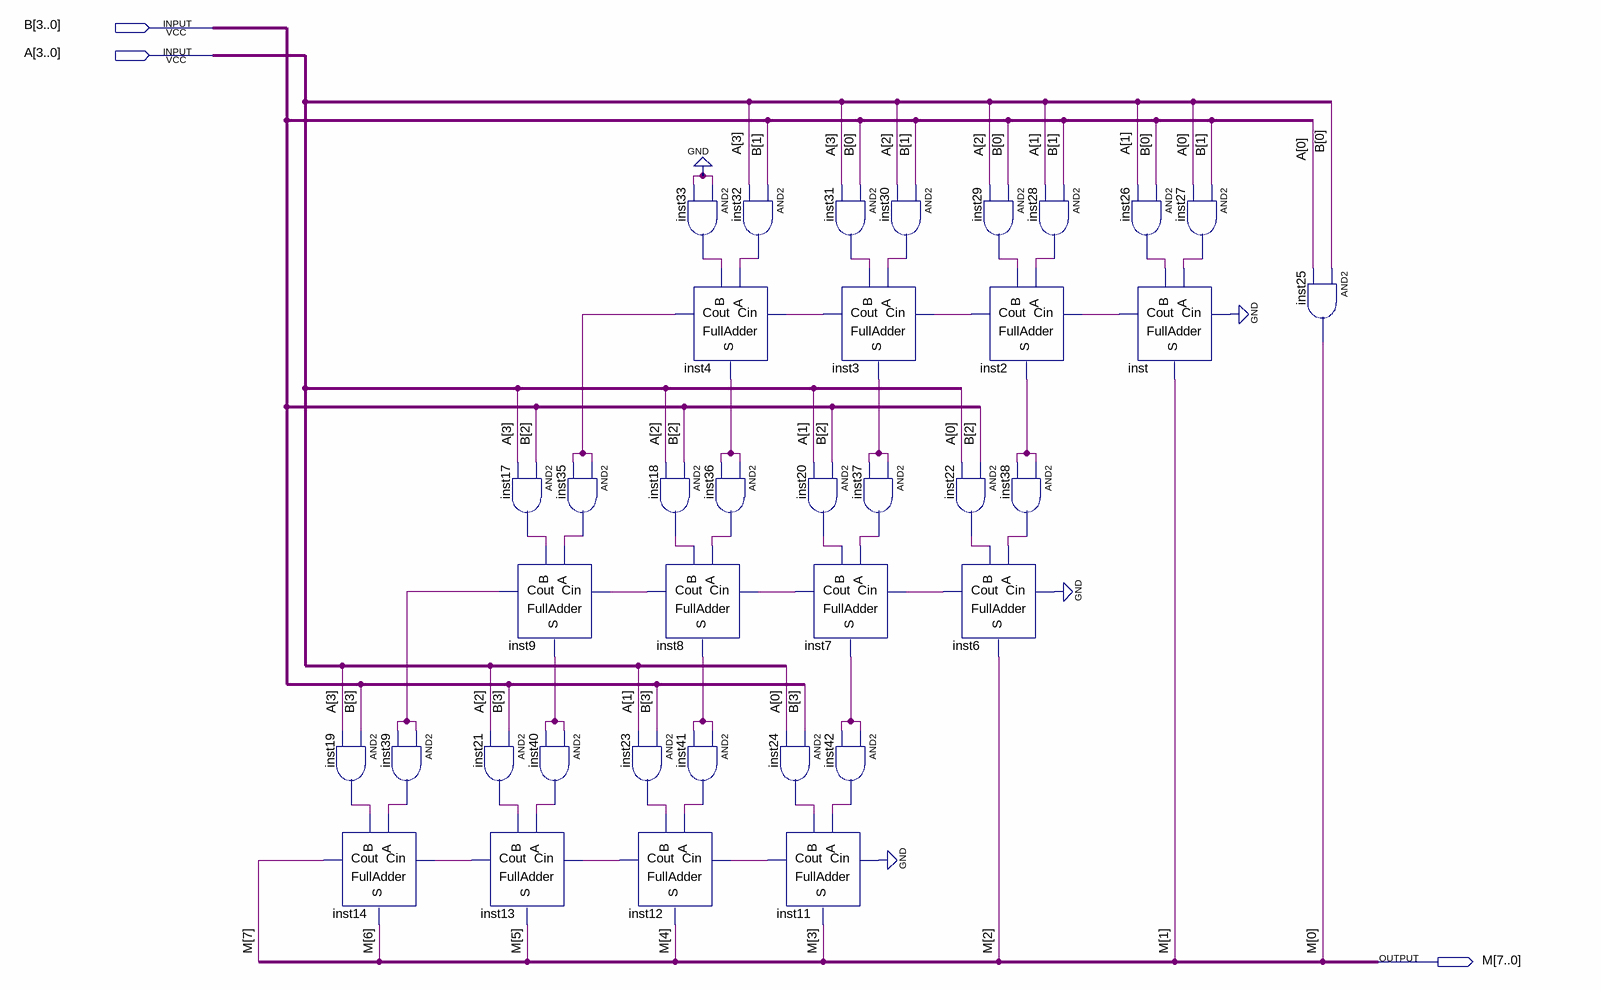
[diagram p0: schematic sheet]
// Quartus schematic Mult.bdf as structural Verilog: 37 symbols, 3 pins
module Mult (
  input  [3:0] B,
  input  [3:0] A,
  output [7:0] M
);

  wire inst2_cout, inst2_s, inst3_cout, inst3_s, inst4_cout, inst4_s, inst6_cout, inst7_cout, inst7_s,
       inst8_cout, inst8_s, inst9_cout, inst9_s, inst11_cout, inst12_cout, inst13_cout, inst17_out,
       inst18_out, inst19_out, inst20_out, inst21_out, inst22_out, inst23_out, inst24_out, inst26_out,
       inst27_out, inst28_out, inst29_out, inst30_out, inst31_out, inst32_out, inst33_out, inst35_out,
       inst36_out, inst37_out, inst38_out, inst39_out, inst40_out, inst41_out, inst42_out, inst_cout;

  and inst19 (inst19_out, B[3], A[3]);
  FullAdder inst14 (.B(inst19_out), .A(inst39_out), .Cin(inst13_cout), .S(M[6]), .Cout(M[7]));
  and inst39 (inst39_out, inst9_cout, inst9_cout);
  and inst21 (inst21_out, B[3], A[2]);
  FullAdder inst13 (.B(inst21_out), .A(inst40_out), .Cin(inst12_cout), .S(M[5]), .Cout(inst13_cout));
  and inst17 (inst17_out, B[2], A[3]);
  and inst35 (inst35_out, inst4_cout, inst4_cout);
  FullAdder inst9 (.B(inst17_out), .A(inst35_out), .Cin(inst8_cout), .S(inst9_s), .Cout(inst9_cout));
  and inst40 (inst40_out, inst9_s, inst9_s);
  and inst23 (inst23_out, B[3], A[1]);
  FullAdder inst12 (.B(inst23_out), .A(inst41_out), .Cin(inst11_cout), .S(M[4]), .Cout(inst12_cout));
  and inst33 (inst33_out, 1'b0, 1'b0);
  FullAdder inst4 (.B(inst33_out), .A(inst32_out), .Cin(inst3_cout), .S(inst4_s), .Cout(inst4_cout));
  and inst18 (inst18_out, B[2], A[2]);
  and inst36 (inst36_out, inst4_s, inst4_s);
  FullAdder inst8 (.B(inst18_out), .A(inst36_out), .Cin(inst7_cout), .S(inst8_s), .Cout(inst8_cout));
  and inst41 (inst41_out, inst8_s, inst8_s);
  and inst32 (inst32_out, B[1], A[3]);
  and inst24 (inst24_out, B[3], A[0]);
  FullAdder inst11 (.B(inst24_out), .A(inst42_out), .Cin(1'b0), .S(M[3]), .Cout(inst11_cout));
  and inst31 (inst31_out, B[0], A[3]);
  FullAdder inst3 (.B(inst31_out), .A(inst30_out), .Cin(inst2_cout), .S(inst3_s), .Cout(inst3_cout));
  and inst20 (inst20_out, B[2], A[1]);
  and inst37 (inst37_out, inst3_s, inst3_s);
  FullAdder inst7 (.B(inst20_out), .A(inst37_out), .Cin(inst6_cout), .S(inst7_s), .Cout(inst7_cout));
  and inst42 (inst42_out, inst7_s, inst7_s);
  and inst30 (inst30_out, B[1], A[2]);
  and inst29 (inst29_out, B[0], A[2]);
  FullAdder inst2 (.B(inst29_out), .A(inst28_out), .Cin(inst_cout), .S(inst2_s), .Cout(inst2_cout));
  and inst22 (inst22_out, B[2], A[0]);
  and inst38 (inst38_out, inst2_s, inst2_s);
  FullAdder inst6 (.B(inst22_out), .A(inst38_out), .Cin(1'b0), .S(M[2]), .Cout(inst6_cout));
  and inst28 (inst28_out, B[1], A[1]);
  and inst26 (inst26_out, B[0], A[1]);
  FullAdder inst (.B(inst26_out), .A(inst27_out), .Cin(1'b0), .S(M[1]), .Cout(inst_cout));
  and inst27 (inst27_out, B[1], A[0]);
  and inst25 (M[0], B[0], A[0]);
endmodule
